# EasyEDA schematic SCH_Stimulus-Shield-(GroeiAcademie-FrameWork)-v1.1.0_2026-08-09.json
TITLE: Stimulus Shield (GroeiAcademie FrameWork); REV: 1.1.0; Date: 2026-08-08; Sheet: 1/1; Drawn By: Alex Peeters; Company: GROEI ACADEMIE
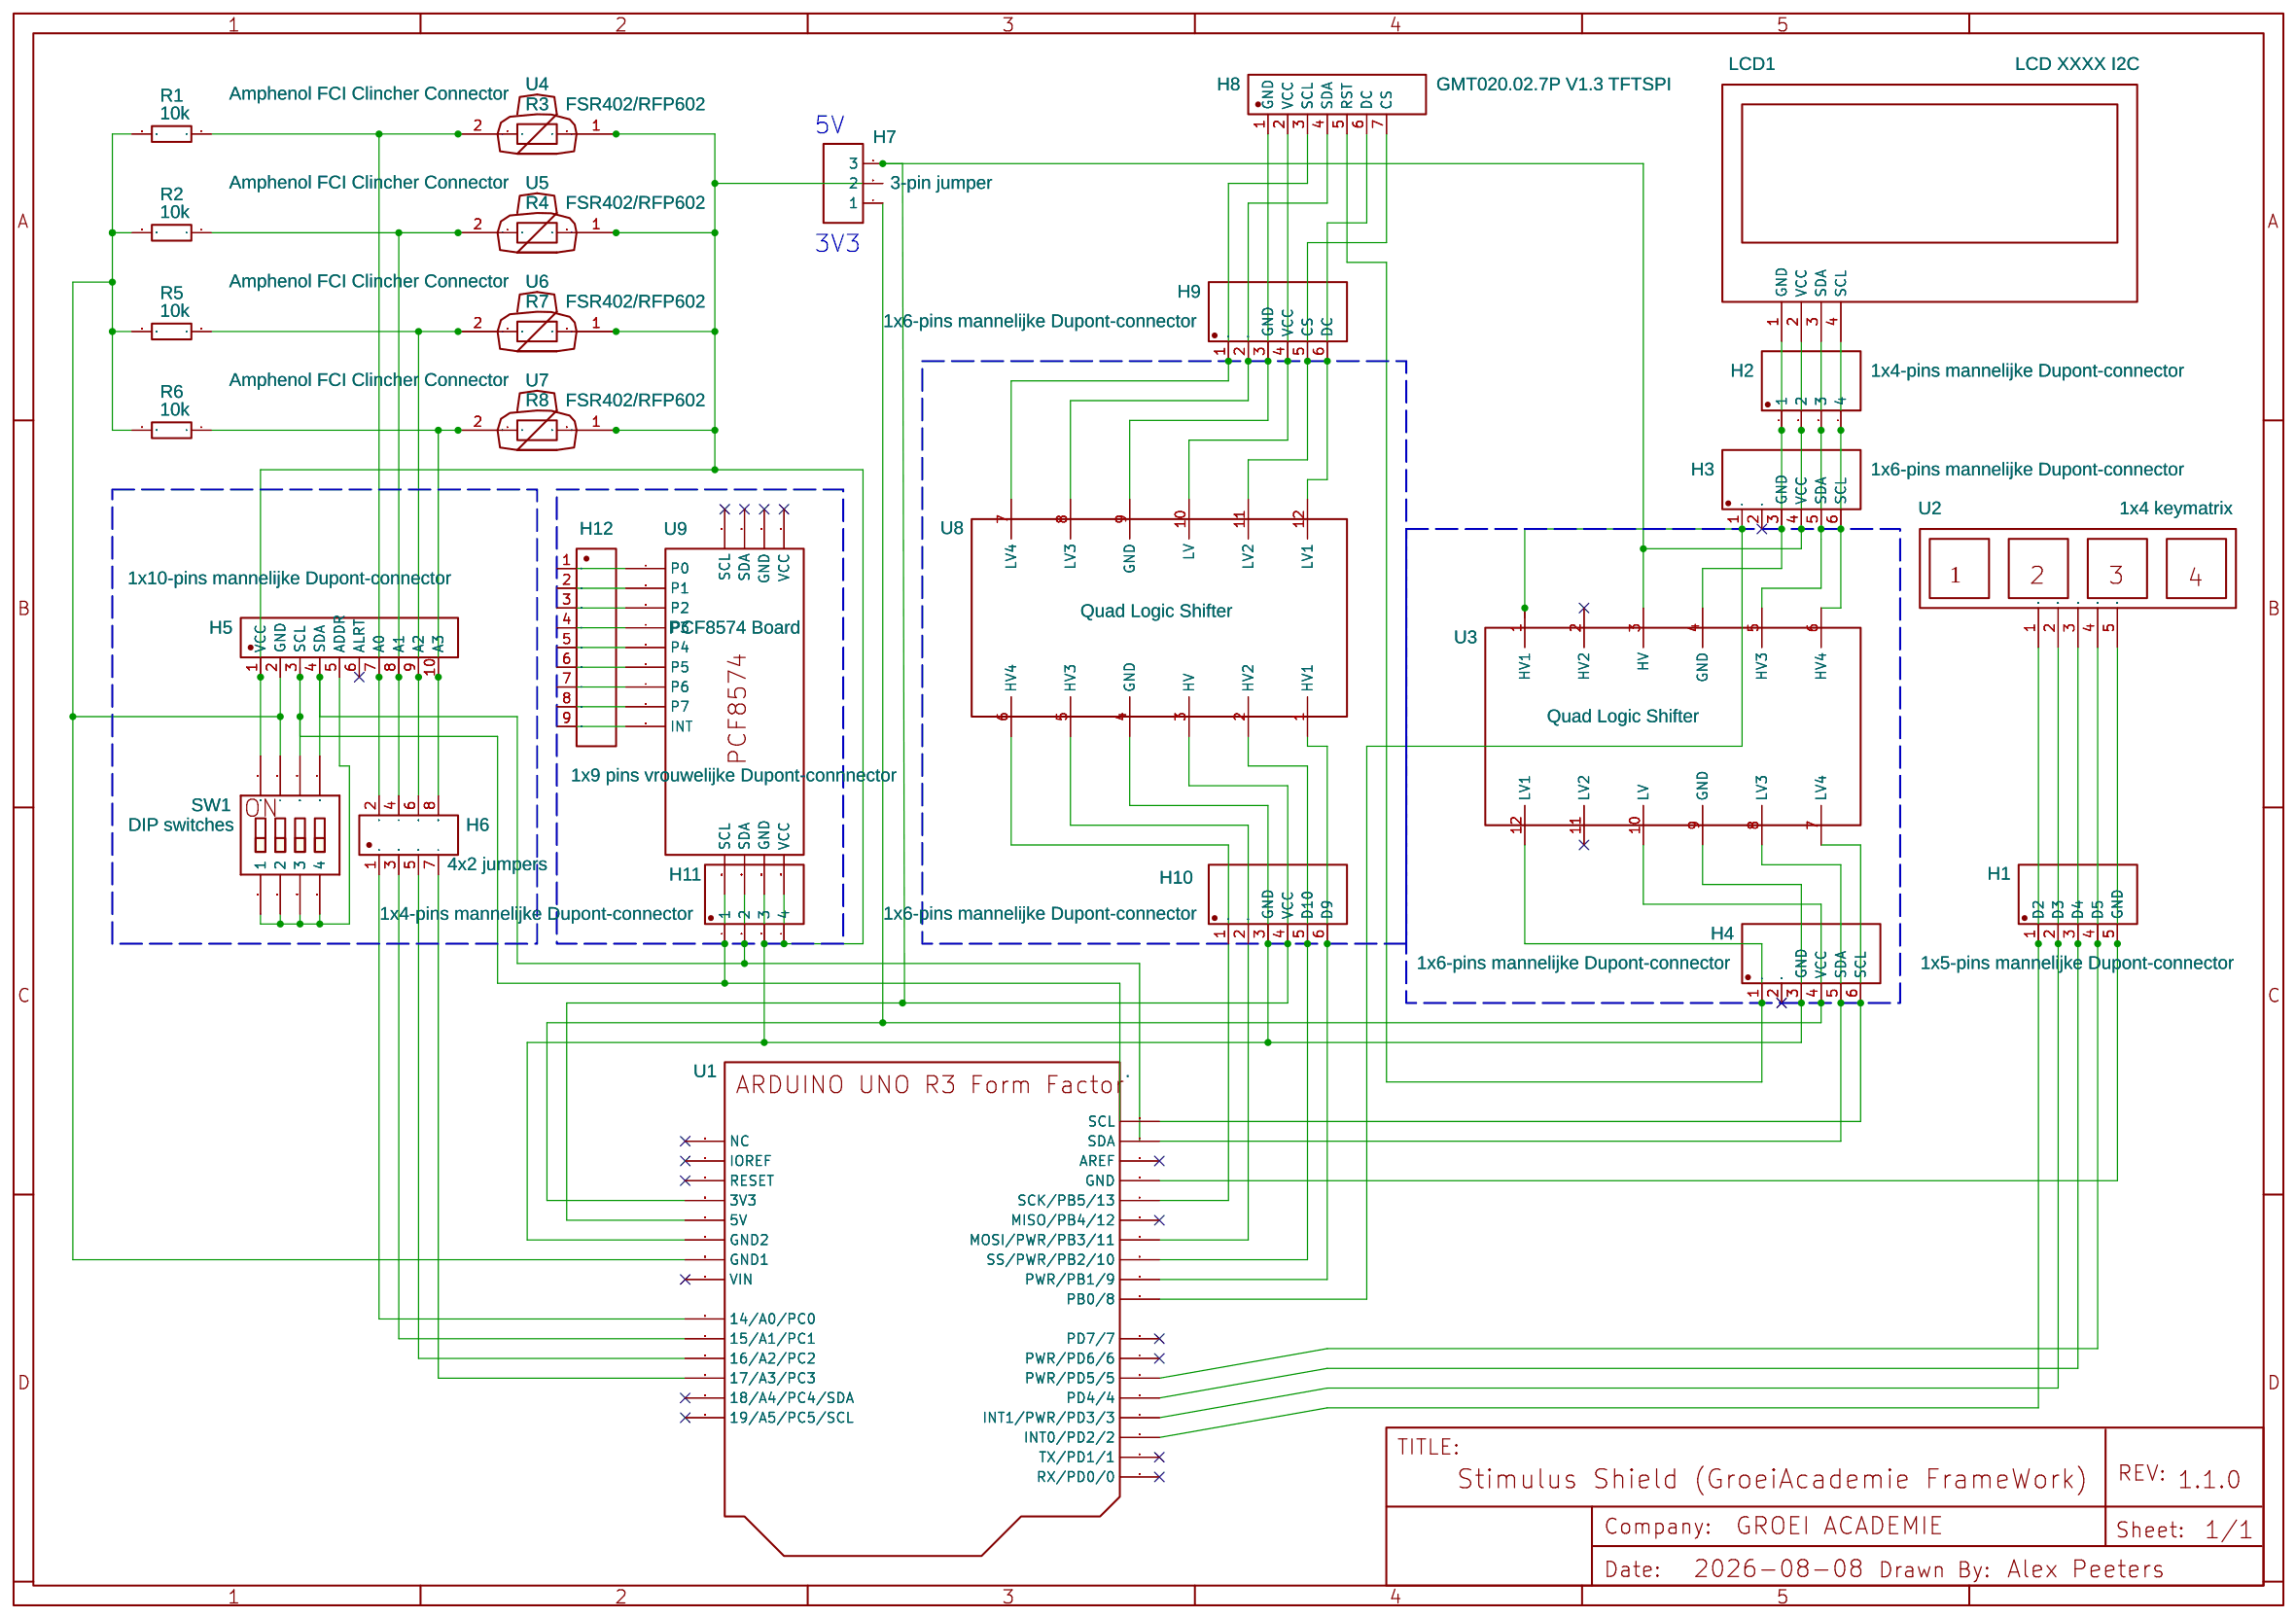
[diagram p0: schematic sheet]

## Parts
H1  1x5-pins mannelijke Dupont-connector  [HDR-TH_5P-P2.54-V-M]
H2  1x4-pins mannelijke Dupont-connector  [HDR-TH_4P-P2.54-V-M]
H3  1x6-pins mannelijke Dupont-connector  [HDR-TH_6P-P2.54-V_Z-211-0611-0021-001]
H4  1x6-pins mannelijke Dupont-connector  [HDR-TH_6P-P2.54-V_Z-211-0611-0021-001]
H5  1x10-pins mannelijke Dupont-connector  [HDR-TH_10P-P2.54-V-M]
H6  4x2 jumpers  [HDR-SMD_8P-P2.54-V-M-R2-C4-LS7.4]
H7  3-pin jumper  [HDR-F-2.54_1X3]
H8  GMT020.02.7P V1.3 TFTSPI  [HDR_2.54M_1X7]
H9  1x6-pins mannelijke Dupont-connector  [HDR-TH_6P-P2.54-V_Z-211-0611-0021-001]
H10  1x6-pins mannelijke Dupont-connector  [HDR-TH_6P-P2.54-V_Z-211-0611-0021-001]
H11  1x4-pins mannelijke Dupont-connector  [HDR-TH_4P-P2.54-V-M]
H12  1x9 pins vrouwelijke Dupont-connnector  [HDR-TH_HX-PM1.27-1X9P-ZC-H2.0]
LCD1  LCD XXXX I2C  [HDR-M-2.54_1X4]
R1  10k  [WEERSTAND _P 10MM]
R2  10k  [WEERSTAND _P 10MM]
R3  FSR402/RFP602  [FSR400]
R4  FSR402/RFP602  [FSR400]
R5  10k  [WEERSTAND _P 10MM]
R6  10k  [WEERSTAND _P 10MM]
R7  FSR402/RFP602  [FSR400]
R8  FSR402/RFP602  [FSR400]
SW1  DIP switches  [DIP SWITCH PACKAGE]
U1  .  [ARDUINO_UNO_SHIELD_EFSHIELD ARDUINO UNO PH]
U2  1x4 keymatrix  [KEYPAD1X4]
U3  Quad Logic Shifter  [LOGIC SHIFTER 4 CH]
U4  Amphenol FCI Clincher Connector  [AT04-2P]
U5  Amphenol FCI Clincher Connector  [AT04-2P]
U6  Amphenol FCI Clincher Connector  [AT04-2P]
U7  Amphenol FCI Clincher Connector  [AT04-2P]
U8  Quad Logic Shifter  [LOGIC SHIFTER 4 CH]
U9  PCF8574 Board

## Library data of the parts
H1 = 210S-1*5P L=11.6MMGold-plated black: Contributor: LCSC; Supplier: LCSC; Manufacturer: Ckmtw(灿科盟); Manufacturer Part: B-2100S05P-A110; Supplier Part: C124379; JLCPCB Part Class: Extended Part
H2 H11 = Header-Male-2.54_1x4: Contributor: LCSC; Supplier: LCSC; Manufacturer: Ckmtw(灿科盟); Manufacturer Part: B-2100S04P-A110; Supplier Part: C124378; JLCPCB Part Class: Extended Part
H3 H4 H9 H10 = 210S-1*6P L=11.6MMGold-plated black: Contributor: LCSC; Supplier: LCSC; Manufacturer: Ckmtw(灿科盟); Manufacturer Part: B-2100S06P-A110; Supplier Part: C124380; JLCPCB Part Class: Extended Part
H5 = 2.54-1*10: Contributor: lcsc; Supplier: LCSC; Supplier Part: C5156617; Manufacturer: ZHOURI(洲日); JLCPCB Part Class: Extended Part
H6 = 2.54-2*4P立贴针: Contributor: LCSC; Supplier: LCSC; Supplier Part: C192300; Manufacturer: BOOMELE(博穆精密); JLCPCB Part Class: Extended Part
H7 = HDR-F-2.54_1x3: Supplier Part: C146690; Supplier: LCSC; Contributor: rahulrahulrahul
H8 = PZ254R-11-08P: Contributor: boehmr77; Supplier: LCSC; Manufacturer Part: HDR-M-L12-3+4-1x8P-2.54; JLCPCB Part Class: Extended Part; PT_NB: B6F-B229; PT_No_SMT: DIP
H12 = HX PM1.27-1X9P ZC H2.0: Supplier: LCSC; Supplier Part: C46061700; Manufacturer: hanxia(韩下); Manufacturer Part: HX PM1.27-1x9P ZC H2.0; Contributor: lcsc; JLCPCB Part Class: Extended Part
LCD1 = I2CLCD16X2_N: Contributor: abdenoura70
R1 R2 R5 R6 = 330Ω (331) ±5%: Supplier: LCSC; Supplier Part: C10322; Manufacturer: Made in China; Contributor: Oldman2019; JLCPCB Part Class: Extended Part
R3 R4 R7 R8 = FSR402-OPCION1: Contributor: N.Morisaki
SW1 = DIP switch 4 Channel: Supplier: LCSC; Manufacturer: KE; Manufacturer Part: DIP switch,Dip Switch,DSWB04LHGET; Contributor: vikhattangady; Supplier Part: C99418
U1 = ARDUINO UNO r3: Contributor: michalkwi2000; sourceId: frlCUcuMG
U2 = Клавиатура 4*4: Contributor: oleg12062005; sourceId: AztLFXf9r
U3 U8 = Quad Logic Shifter: Contributor: wsarchibald1
U4-U7 = AT04-2P: Manufacturer: Amphenol; Manufacturer Part: AT04-2P-BM02; Supplier: Mouser; Supplier Part: 654-AT04-2P-BM02; link: https://www.amphenol-sine.com/AT04-2P-BM02-2-Position-PCB-Flange-Mount-Receptacle-Pin-Gold-Plated-Contacts-Included-Potting-Black_p_9831.html; Contributor: aryde
U9 = PCF8574 IO Expansion Board: Manufacturer: WaveShare; Supplier: WaveShare; link: https://www.waveshare.com/pcf8574-io-expansion-board.htm; Contributor: eugeneinmile

## Nets
Net-(H1-1): H1.1(D2) U1.3(INT0/PD2/2) U2.1(C1)
Net-(H1-2): H1.2(D3) U1.4(INT1/PWR/PD3/3) U2.2(C2)
Net-(H1-3): H1.3(D4) U1.5(PD4/4) U2.3(C3)
Net-(H1-4): H1.4(D5) U1.6(PWR/PD5/5) U2.4(R1)
Net-(H1-5): H1.5(GND) U1.15(GND) U2.5(R2)
Net-(H2-1): H2.1 H3.3(GND) LCD1.1(GND) U3.4(GND)
Net-(H2-2): H2.2 H3.4(VCC) H7.3 H10.4(VCC) LCD1.2(VCC) U1.28(5V) U3.3(HV) U8.3(HV)
Net-(H2-3): H2.3 H3.5(SDA) LCD1.3(SDA) U3.5(HV3)
Net-(H2-4): H2.4 H3.6(SCL) LCD1.4(SCL) U3.6(HV4)
Net-(H3-1): H3.1 U1.9(PB0/8) U3.1(HV1)
Net-(H4-1): H4.1 H8.5(RST) U3.12(LV1)
Net-(H4-3): H4.3(GND) H10.3(GND) H11.3 U1.27(GND2) U3.9(GND) U8.4(GND) U9.GND
Net-(H4-4): H4.4(VCC) H7.1 U1.29(3V3) U3.10(LV)
Net-(H4-5): H4.5(SDA) U1.17(SDA) U3.8(LV3)
Net-(H4-6): H4.6(SCL) U1.18(SCL) U3.7(LV4)
Net-(H5-1): H5.1(VCC) H7.2 H11.4 R3.2 R4.2 R7.2 R8.2 SW1.1I(8) U4.1 U5.1 U6.1 U7.1 U9.VCC
Net-(H5-2): H5.2(GND) R1.2 R2.2 R5.2 R6.2 SW1.2I(7) U1.26(GND1)
Net-(H5-3): H5.3(SCL) H11.1 SW1.3I(6) U9.SCL
Net-(H5-4): H5.4(SDA) H11.2 SW1.4I(5) U9.SDA
Net-(H5-5): H5.5(ADDR) SW1.1O(1) SW1.2O(2) SW1.3O(3) SW1.4O(4)
Net-(H5-7): H5.7(A0) H6.2 R1.1 R3.1 U4.2
Net-(H5-8): H5.8(A1) H6.4 R2.1 R4.1 U5.2
Net-(H5-9): H5.9(A2) H6.6 R5.1 R7.1 U6.2
Net-(H5-10): H5.10(A3) H6.8 R6.1 R8.1 U7.2
Net-(H6-1): H6.1 U1.24(14/A0/PC0)
Net-(H6-3): H6.3 U1.23(15/A1/PC1)
Net-(H6-5): H6.5 U1.22(16/A2/PC2)
Net-(H6-7): H6.7 U1.21(17/A3/PC3)
Net-(H8-1): H8.1(GND) H9.3(GND) U8.9(GND)
Net-(H8-2): H8.2(VCC) H9.4(VCC) U8.10(LV)
Net-(H8-3): H8.3(SCL) H9.1 U8.7(LV4)
Net-(H8-4): H8.4(SDA) H9.2 U8.8(LV3)
Net-(H8-6): H8.6(DC) H9.6(DC) U8.12(LV1)
Net-(H8-7): H8.7(CS) H9.5(CS) U8.11(LV2)
Net-(H10-1): H10.1 U1.14(SCK/PB5/13)
Net-(H10-2): H10.2 U1.12(MOSI/PWR/PB3/11)
Net-(H10-5): H10.5(D10) U1.11(SS/PWR/PB2/10) U8.2(HV2)
Net-(H10-6): H10.6(D9) U1.10(PWR/PB1/9) U8.1(HV1)
Net-(H12-1): H12.1 U9.1(P0)
Net-(H12-2): H12.2 U9.2(P1)
Net-(H12-3): H12.3 U9.3(P2)
Net-(H12-4): H12.4 U9.4(P3)
Net-(H12-5): H12.5 U9.5(P4)
Net-(H12-6): H12.6 U9.6(P5)
Net-(H12-7): H12.7 U9.7(P6)
Net-(H12-8): H12.8 U9.8(P7)
Net-(H12-9): H12.9 U9.9(INT)

Not connected (* = marked no-connect by the designer): H3 2*; H4 2*; H5 6(ALRT)*; U1 1(RX/PD0/0)* 2(TX/PD1/1)* 7(PWR/PD6/6)* 8(PD7/7)* 13(MISO/PB4/12)* 16(AREF)* 19(19/A5/PC5/SCL)* 20(18/A4/PC4/SDA)* 25(VIN)* 30(RESET)* 31(IOREF)* 32(NC)*; U3 2(HV2)* 11(LV2)*; U8 5(HV3) 6(HV4); U9 10(SCL)* 11(SDA)* 12(GND)* 13(VCC)*

## Notes on the sheet
- 5V
- 3V3
